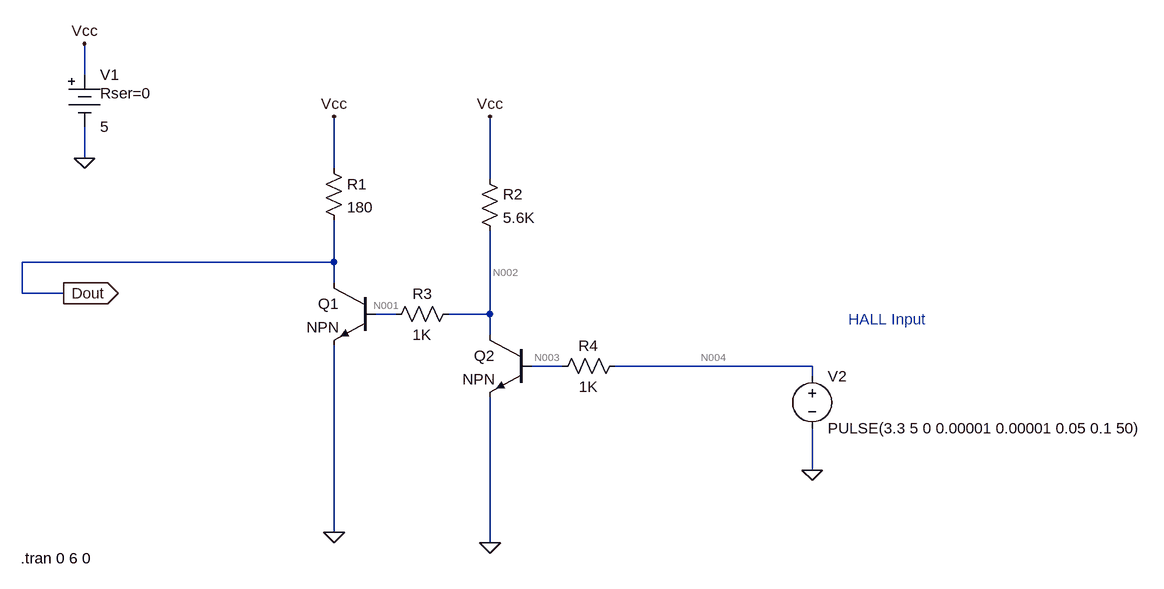
[diagram p0: schematic BoschSeatMotorLevelShifter.asc]
BoschSeatMotorLevelShifter.asc, the LTspice schematic file:
Version 4
SHEET 1 1344 680
WIRE -320 -464 -320 -512
WIRE -320 -336 -320 -384
WIRE 64 -320 64 -400
WIRE 304 -304 304 -400
WIRE 64 -176 64 -240
WIRE 64 -176 -416 -176
WIRE 64 -144 64 -176
WIRE -416 -128 -416 -176
WIRE -352 -128 -416 -128
WIRE 160 -96 128 -96
WIRE 304 -96 304 -224
WIRE 304 -96 240 -96
WIRE 304 -64 304 -96
WIRE 416 -16 368 -16
WIRE 800 -16 496 -16
WIRE 800 0 800 -16
WIRE 800 144 800 80
WIRE 64 240 64 -48
WIRE 304 256 304 32
FLAG 64 240 0
FLAG 304 256 0
FLAG -352 -128 Dout
IOPIN -352 -128 Out
FLAG 64 -400 Vcc
FLAG 304 -400 Vcc
FLAG -320 -336 0
FLAG -320 -512 Vcc
FLAG 800 144 0
SYMBOL npn 128 -144 M0
SYMATTR InstName Q1
SYMBOL npn 368 -64 M0
SYMATTR InstName Q2
SYMBOL Misc\\battery -320 -480 R0
WINDOW 123 0 0 Left 0
WINDOW 39 24 44 Left 2
SYMATTR InstName V1
SYMATTR Value 5
SYMATTR SpiceLine Rser=0
SYMBOL res 48 -336 R0
SYMATTR InstName R1
SYMATTR Value 180
SYMBOL res 288 -320 R0
SYMATTR InstName R2
SYMATTR Value 5.6K
SYMBOL res 256 -112 R90
WINDOW 0 0 56 VBottom 2
WINDOW 3 32 56 VTop 2
SYMATTR InstName R3
SYMATTR Value 1K
SYMBOL res 512 -32 R90
WINDOW 0 0 56 VBottom 2
WINDOW 3 32 56 VTop 2
SYMATTR InstName R4
SYMATTR Value 1K
SYMBOL voltage 800 -16 R0
WINDOW 123 0 0 Left 0
WINDOW 39 0 0 Left 0
SYMATTR InstName V2
SYMATTR Value PULSE(3.3 5 0 0.00001 0.00001 0.05 0.1 50)
TEXT 856 -88 Left 2 ;HALL Input
TEXT -418 280 Left 2 !.tran 0 6 0

The netlist it stands for:
* BoschSeatMotorLevelShifter.asc
Q1 Dout N001 0 0 NPN
Q2 N002 N003 0 0 NPN
V1 Vcc 0 5 Rser=0
R1 Vcc Dout 180
R2 Vcc N002 5.6K
R3 N002 N001 1K
R4 N004 N003 1K
V2 N004 0 PULSE(3.3 5 0 0.00001 0.00001 0.05 0.1 50)
.model NPN NPN
.model PNP PNP
.lib standard.bjt
* HALL Input
.tran 0 6 0
.backanno
.end

* Results of the author's LTspice run, read from the files saved beside the schematic
* Operating Point, zero values left out:
*   V(dout) = 5 V
*   V(n001) = 22.28 mV
*   V(n002) = 22.28 mV
*   V(n003) = 819.4 mV
*   V(vcc) = 5 V
*   V(n004) = 3.3 V
*   Ic(Q2) = 888.9 µA
*   Ib(Q2) = 2.481 mA
*   Ie(Q2) = -3.369 mA
*   Ic(Q1) = 4.978 pA
*   Ib(Q1) = -4.956 pA
*   I(R4) = 2.481 mA
*   I(R3) = -4.956 pA
*   I(R2) = 888.9 µA
*   I(R1) = 4.978 pA
*   I(V2) = -2.481 mA
*   I(V1) = -888.9 µA
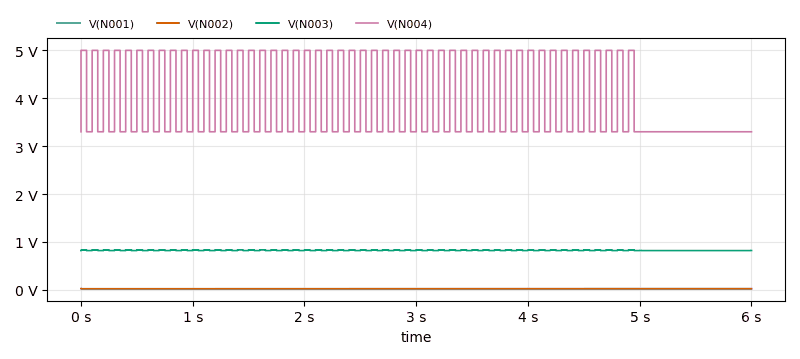
[diagram p1: Transient Analysis of BoschSeatMotorLevelShifter.asc, plotted from the saved traces]
* Transient Analysis, 1 run:
*   V(N001): min 20.59 mV, max 22.28 mV, average 21.58 mV, rms 21.6 mV, last 22.28 mV
*   V(N002): min 20.59 mV, max 22.28 mV, average 21.58 mV, rms 21.6 mV, last 22.28 mV
*   V(N003): min 819.4 mV, max 831.2 mV, average 824.3 mV, rms 824.3 mV, last 819.4 mV
*   V(N004): min 3.3 V, max 5 V, average 4.008 V, rms 4.095 V, last 3.3 V